# Altium schematic sheet PG04_Schematic Sheet2.SchDoc: Sheet 2  433 MHz Transmitter
size B; Date: 12/29/2011; ApprovedBy: Touraj; DrawnBy: Touraj Ghaffari; Engineer: Touraj; Organization: ActiveWave; Address1: 902 Clint Moore Rd., Suite 126; Address2: Boca Raton; Address3: FL, 33487; Address4: 561-999-9422; DocumentNumber: 4; Revision: 1; SheetNumber: 4; SheetTotal: 6; PageSetup: Record=PageOptions|CenterHorizontal=True|CenterVertical=True|PrintScale=0.70|XCorrection=1.00|YCorrection=1.00|PrintKind=0|BorderSize=5000000|LeftOffset=0|BottomOffset=0|Orientation=2|PaperLength=1000|PaperWidth=1000|Scale=100|PaperSource=7|PrintQuality=-4|MediaType=1|DitherType=10|PaperKind=Letter|PrintScaleMode=1; Project: Samll Hand Held Reader
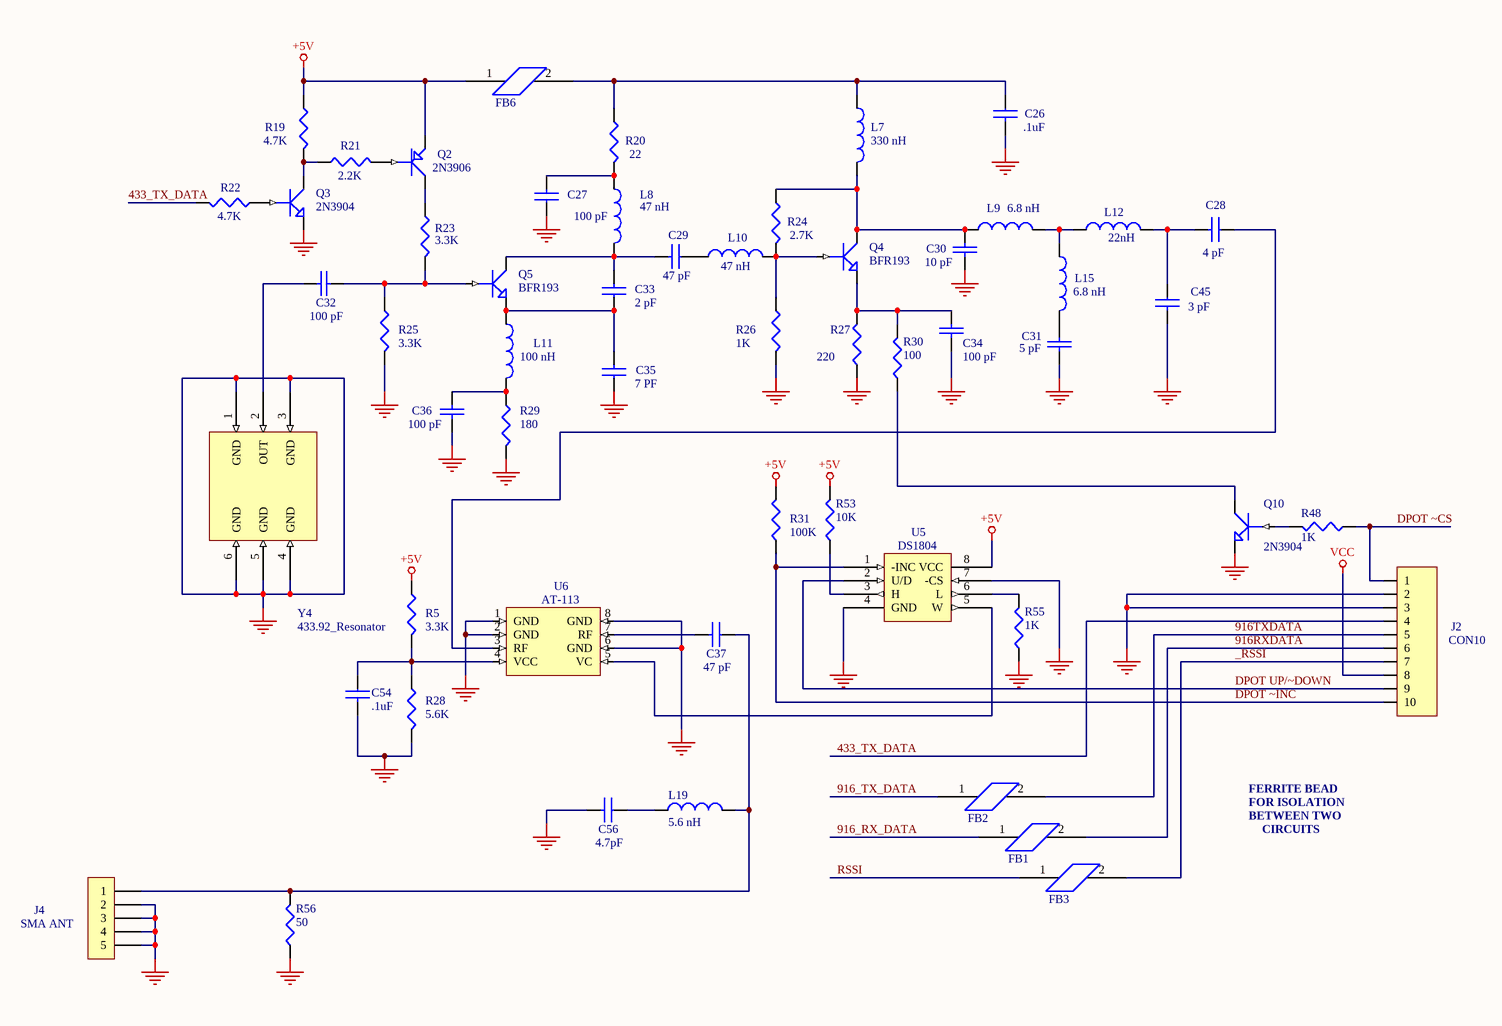
[diagram p0: PG04_Schematic Sheet2.SchDoc]

## Parts
C26  .1uF  [0603]
C27  100 pF  [0603]
C28  4 pF  [0603]
C29  47 pF  [0603]
C30  10 pF  [0603]
C31  5 pF  [0603]
C32  100 pF  [0603]
C33  2 pF  [0603]
C34  100 pF  [0603]
C35  7 PF  [0603]
C36  100 pF  [0603]
C37  47 pF  [0603]
C45  3 pF  [0603]
C54  .1uF  [0603]
C56  4.7pF  [0603]
FB1  FB  [0603]  (value not drawn)
FB2  FB  [0603]  (value not drawn)
FB3  FB  [0603]  (value not drawn)
FB6  FB  [0603]  (value not drawn)
J2  CON10  [1X10 HEADER]
J4  SMA ANT  [50 OHM ANT]
L7  330 nH  [0805]
L8  47 nH  [0603]
L9  6.8 nH  [0603]
L10  47 nH  [0603]
L11  100 nH  [0603]
L12  22nH  [0603]
L15  6.8 nH  [0603]
L19  5.6 nH  [0603]
Q2  2N3906  [SOT23 TRANS]
Q3  2N3904  [SOT23 TRANS]
Q4  BFR193  [SOT23 TRANS]
Q5  BFR193  [SOT23 TRANS]
Q10  2N3904  [SOT23 TRANS]
R5  3.3K  [0603]
R19  4.7K  [0603]
R20  22  [0603]
R21  2.2K  [0603]
R22  4.7K  [0603]
R23  3.3K  [0603]
R24  2.7K  [0603]
R25  3.3K  [0603]
R26  1K  [0603]
R27  220  [0603]
R28  5.6K  [0603]
R29  180  [0603]
R30  100  [0603]
R31  100K  [0603]
R48  1K  [0603]
R53  10K  [0603]
R55  1K  [0603]
R56  50  [0603]
U5  DS1804  [SO8 SMALL]
U6  AT-113  [SO8]
Y4  433.92_Resonator  [RESONATOR2]

## Nets
+5V: FB6.1 Q2.E R5.1 R19.1 R31.1 R53.2 U5.8(VCC)
GND_SIGNAL: C26.2 C27.1 C30.2 C31.2 C34.2 C35.1 C36.2 C45.2 C54.2 C56.2 J2.2 J2.3 J4.2 J4.3 J4.4 J4.5 Q3.E Q10.E R25.2 R26.2 R27.2 R28.2 R29.2 R55.1 R56.1 U5.4(GND) U5.7(-CS) U6.1(GND) U6.2(GND) U6.6(GND) U6.8(GND) Y4.1(GND) Y4.3(GND) Y4.4(GND) Y4.5(GND) Y4.6(GND)
VCC: J2.8
433_TX_DATA: J2.4 R22.2
916_RX_DATA: FB1.1
916_TX_DATA: FB2.1
916RXDATA: FB1.2 J2.6
916TXDATA: FB2.2 J2.5
_RSSI: FB3.2 J2.7
DPOT UP/~DOWN: J2.9 U5.2(U/D)
DPOT ~CS: J2.1 R48.2
DPOT ~INC: J2.10 R31.2 U5.1(-INC)
RSSI: FB3.1
NetC26_1: C26.1 FB6.2 L7.1 R20.1
NetC27_2: C27.2 L8.1 R20.2
NetC28_1: C28.1 U6.3(RF)
NetC28_2: C28.2 C45.1 L12.2
NetC29_1: C29.1 L10.1
NetC29_2: C29.2 C33.2 L8.2 Q5.C
NetC30_1: C30.1 L7.2 L9.1 Q4.C R24.1
NetC31_1: C31.1 L15.2
NetC32_1: C32.1 Y4.2(OUT)
NetC32_2: C32.2 Q5.B R23.2 R25.1
NetC33_1: C33.1 C35.2 L11.1 Q5.E
NetC34_1: C34.1 Q4.E R27.1 R30.2
NetC36_1: C36.1 L11.2 R29.1
NetC37_1: C37.1 J4.1 L19.2 R56.2
NetC37_2: C37.2 U6.7(RF)
NetC54_1: C54.1 R5.2 R28.1 U6.4(VCC)
NetC56_1: C56.1 L19.1
NetL9_2: L9.2 L12.1 L15.1
NetL10_2: L10.2 Q4.B R24.2 R26.1
NetQ2_B: Q2.B R21.2
NetQ2_C: Q2.C R23.1
NetQ3_B: Q3.B R22.1
NetQ3_C: Q3.C R19.2 R21.1
NetQ10_B: Q10.B R48.1
NetQ10_C: Q10.C R30.1
NetR53_1: R53.1 U5.3(H)
NetR55_2: R55.2 U5.6(L)
NetU5_5: U5.5(W) U6.5(VC)

## Notes on the sheet
- FERRITE BEAD
- FOR ISOLATION
- BETWEEN TWO
- CIRCUITS
- APPROVALS
- DATE
- Title:
- Drawn:
- Checked:
- Release:
- Date:
- Size:
- Sheet Name:
- B
- Number:
- Time:
- Revision:
- Sheet
- of
- File:

## Library data of the parts
C26-C29 C33 C35 C37 C45 C54 C56 = CAP_NP: Text Field1: 20; Text Field2: 10
C30-C32 C34 C36 = CAP: Capacitor
FB1-FB3 FB6 = FB_0603: Part Field 1: Part Number EXC-ML16A270U; Part Field 2: Vendor Panasonic - ECG; Part Field 3: Description BEAD CORE 27 OHM 4A 0603 SMD
J2 = CON10: Text Field1: 30; Text Field2: 110
J4 = CON5: Connector
L7-L12 L15 L19 = INDUCTOR: Text Field1: 20; Text Field2: 40
Q2 = PNP1: PNP Transistor
Q3-Q5 Q10 = NPN1: NPN Transistor
R5 R19-R31 R48 R53 R55 R56 = RESISTOR: Text Field1: 20; Text Field2: 30
U5 = DS1804: Text Field1: 50; Text Field2: 50
U6 = AT-113A
Y4 = RESONATOR2